# EasyEDA Pro project PCB信仰尺子.eprj, board PCB信仰尺V1.0
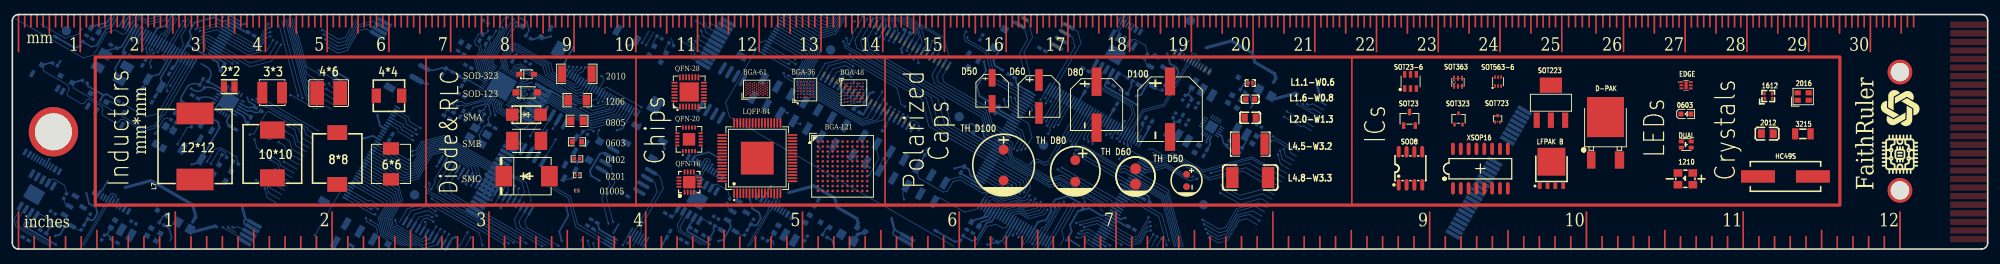
[diagram p0: board, top side]
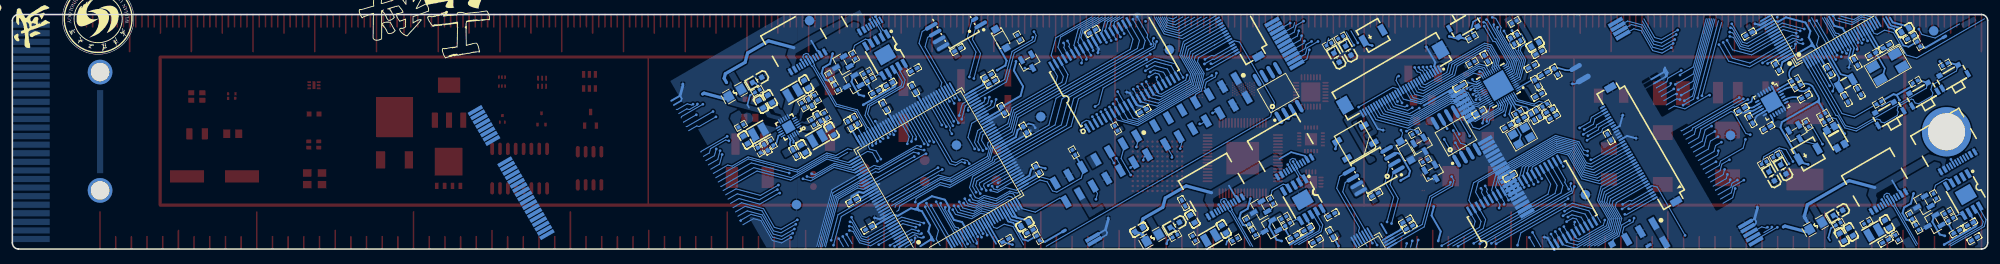
[diagram p1: board, bottom side, seen from below]

Outline 320 x 38 mm; copper layers: Top Layer, Bottom Layer. Coordinates in mm from the lower left corner of the outline.
Outline path: 0,37 0,1 arc(0.29,0.29) 1,0 319,0 arc(319.71,0.29) 320,1 320,37 arc(319.71,37.71) 319,38 1,38 arc(0.29,37.71) 0,37
Stack: Top Layer 0.035mm / Dielectric1 1.51mm FR4 er 4.5 / Bottom Layer 0.035mm

## Design rules (mm)
spacing copperThickness1oz (default): track to track 0.102, other pairs 0.152 to 0.3
spacing copperThickness2oz: track to track 0.203, other pairs 0.152 to 0.3
spacing Plane_innerPlane: track to track 0.102, other pairs 0.152 to 0.3
spacing Copper_copperRegion: track to track 0.102, other pairs 0.152 to 0.3
track width copperThickness1oz (default): min 0.127, default 0.254, max 2.54
track width copperThickness2oz: min 0.203, default 0.254, max 2.54
differential pair differentialPair (default): width min 0.127, default 0.254, max 2.54; gap min 0.152, default 0.152
via viaSize (default): diameter min 0.5, default 0.61, max 10; hole min 0.3, default 0.305, max 6.3
pour e5366 uses Copper_copperRegion
pour e5854 uses Copper_copperRegion

## Placement (name value [footprint] x y rotation side)
0603  KT-0603R  [LED0603-RD]  271.12 21.89 0 top
1210  597-7701-507F  [LED-SMD_4P-L3.0-W2.5_597-7701-507F]  271.03 11.38 0 top
1612  AMPDGEI-A09T  [OSC-SMD_4P-L1.6-W1.2-BL_ABRACON_AMPMG]  284.45 24.79 0 top
2012  100uH  [L0805]  284.3 18.7 0 top
2016  9S26000033  [OSC-SMD_4P-L2.0-W1.6-BL]  290.12 24.72 0 top
3215  32.768kHz  [FC-135R_L3.2-W1.5]  290.07 18.67 0 top
BUZZER1  -  [BUZ-SMD_L4.0-W4.0-P3.50-L]  29.07 15.4 150 bottom
BUZZER1#2  -  [BUZ-SMD_L4.0-W4.0-P3.50-L]  99.56 34.62 150 bottom
C1  -  [CAP-TH_BD8.0-P3.50-D0.6-FD_1]  172.2 12.65 270 top
C1#2  -  [C0402]  25.68 28.88 60 bottom
C2  -  [CAP-TH_BD6.3-P2.50-D0.6-FD]  181.96 11.76 270 top
C2#2  -  [C0402]  20.78 25.48 240 bottom
C3  10pF  [C0402]  22.89 24.29 240 bottom
C4  100nF  [C0402]  21.34 30.24 60 bottom
C5  22pF  [C0402]  18.62 31.58 150 bottom
C6  -  [CAP-SMD_L1.1-W0.6]  200.53 26.9 0 top
C6#2  -  [C0402]  16.44 32.84 330 bottom
C6#3  -  [C0402]  159.06 1.4 330 bottom
C7  -  [C0402]  12.49 34.31 330 bottom
C7#2  -  [C0402]  155.11 2.87 330 bottom
C8  100nF  [C0402]  153.91 12.87 60 bottom
C9  -  [CAP-SMD_L4.5-W3.2-1]  200.53 17 0 top
C9#2  -  [C0402]  155.96 19.35 60 bottom
C10  100nF  [C0402]  159.52 22.53 60 bottom
C11  -  [C0402]  94.24 4.53 330 bottom
C11#2  -  [C0402]  161.91 28.03 330 bottom
C12  -  [C0402]  106.31 2.42 60 bottom
C12#2  -  [C0402]  173.98 25.91 60 bottom
C13  -  [C0402]  108.79 1.27 150 bottom
C13#2  -  [C0402]  2.15 1.67 150 bottom
C13#3  -  [C0402]  178.68 23.06 60 bottom
C14  100nF  [C0402]  184.37 20.19 60 bottom
C15  100nF  [C0402]  183.79 7.81 330 bottom
C16  -  [C0402]  38.67 34.85 330 bottom
C16#2  -  [C0402]  181.29 3.4 330 bottom
C17  100nF  [C0402]  34.09 29.42 60 bottom
C18  -  [C0402]  99.21 8.83 150 bottom
C18#2  -  [C0402]  166.88 32.32 150 bottom
C19  100nF  [C0402]  136.76 22.4 330 bottom
C20  -  [C0402]  77.36 11.78 330 bottom
C20#2  -  [C0402]  145.03 35.28 330 bottom
C21  100nF  [C0402]  61.31 18.12 240 bottom
C22  -  [C0603]  13.35 35.48 150 bottom
C22#2  -  [C0603]  155.98 4.03 150 bottom
C23  2.2uF  [C0402]  183.36 20.79 60 bottom
C24  -  [C0402]  93.64 3.53 330 bottom
C24#2  -  [C0402]  161.31 27.02 330 bottom
C25  100nF  [C0402]  38.36 20.88 240 bottom
C26  100nF  [C0402]  35.7 19.65 150 bottom
C28  -  [C0402]  112.45 1.95 330 bottom
C28#2  -  [C0402]  5.01 2.78 330 bottom
C28#3  -  [C0402]  180.12 25.44 330 bottom
C30  10nF  [C0402]  39.85 22.64 330 bottom
C40  -  [C0402]  110.27 3.22 150 bottom
C40#2  -  [C0402]  2.82 4.06 150 bottom
C40#3  -  [C0402]  177.93 26.72 150 bottom
C41  -  [C0402]  106.25 5.55 330 bottom
C41#2  -  [C0402]  173.91 29.04 330 bottom
C42  -  [C0603]  128.83 4.88 60 bottom
C42#2  -  [C0603]  23.62 1.92 60 bottom
C42#3  -  [C0603]  198.73 23.46 60 bottom
C43  -  [C0603]  137.49 3.13 150 bottom
C43#2  -  [C0603]  22.16 2.78 60 bottom
C43#3  -  [C0603]  197.27 24.32 60 bottom
C44  220pF  [C0402]  197.9 16.45 240 bottom
C45  10uF  [C0603]  201.22 17.7 60 bottom
C46  -  [C0402]  130.28 7.45 240 bottom
C46#2  -  [C0402]  16.54 1.27 330 bottom
C46#3  -  [C0402]  190.76 23.73 240 bottom
C47  -  [C0603]  123.75 3.22 240 bottom
C47#2  -  [C0603]  16.3 4.06 240 bottom
C47#3  -  [C0603]  191.41 26.72 240 bottom
C48  220pF  [C0402]  189.35 21.22 240 bottom
C49  10uF  [C0603]  187.28 19.09 240 bottom
C50  10uF  [C0603]  191.88 16.24 60 bottom
C51  1uF  [C0402]  193.26 15.58 60 bottom
C70  100nF  [C0402]  72.73 24.94 330 bottom
C71  10uF  [C0603]  73.31 33.16 150 bottom
C72  1uF  [C0402]  72.7 31.83 330 bottom
C73  100nF  [C0402]  73.88 29.58 330 bottom
C74  TBD  [C0402]  69.94 28.77 240 bottom
C75  TBD  [C0402]  73.09 26.92 240 bottom
C76  270pF(NC)  [C0402]  75.95 34.27 60 bottom
C77  270pF(NC)  [C0402]  76.96 33.7 240 bottom
C78  100nF  [C0402]  81.27 30.91 240 bottom
C79  4.7uF  [C0402]  85.46 26.37 150 bottom
C80  100nF  [C0402]  82.34 22.14 150 bottom
C81  22pF  [C0402]  77.75 19.85 150 bottom
C82  22pF  [C0402]  75.56 21.06 330 bottom
C83  1uF  [C0402]  73.69 21.41 60 bottom
C84  100pF  [C0402]  72.83 21.91 60 bottom
C85  3.3nF  [C0402]  70.96 22.38 150 bottom
C86  10nF  [C0402]  70.39 21.38 330 bottom
C87  2.2nF  [C0402]  29.62 24.66 150 bottom
D1  -  [DO-214AC_L4.3-W2.7-LS5.3-RD]  83.27 21.77 0 top
D1#2  -  [SOD-123_L2.7-W1.6-LS3.8-RD]  94.28 15.93 240 bottom
D1#3  -  [SOD-123_L2.7-W1.6-LS3.8-RD]  159.87 34.12 240 bottom
D2  -  [SOD-323_L1.8-W1.3-LS2.5-RD]  83.31 28.32 0 top
D50  100uF  [CAP-SMD_BD5.0-L5.3-W5.3-FD]  158.72 25.65 270 top
D60  47uF  [CAP-SMD_BD6.3-L6.6-W6.6-LS7.2-FD]  166.32 24.73 270 top
D80  220uF  [CAP-SMD_BD8.0-L8.3-W8.3-LS9.3-FD]  175.64 23.39 270 top
D100  470uF  [CAP-SMD_BD10.0-L10.3-W10.3-LS11.3-FD]  187.55 22.66 270 top
D-PAK  L78M05ABDT-TR  [TO-252-2_L6.5-W6.1-P4.58-LS10.0-TL]  258.06 17.91 90 top
DUAL  YELLOWBLUE/RED  [LED-ARRAY-SMD_4P-L1.6-W1.5-BR-1]  271.17 16.94 180 top
EDGE  MIC5308-1.2YMT-TR  [MLF-6_L1.6-W1.6-P0.50-TL-EP]  271.14 26.55 0 top
F1  -  [F0805]  135.27 1.81 330 bottom
F1#2  -  [F0805]  27.82 3.76 330 bottom
F1#3  -  [F0805]  202.93 25.3 330 bottom
FPC1  -  [FPC-SMD_F0502-B-35-15T-R]  56.97 16.28 60 bottom
FPC2  -  [FPC-SMD_30P-P0.50_XUNPU_FPC-05F-30PH20]  95.74 26.67 330 bottom
H1  -  [HDR-SMD_14P-P2.54-H-F-R2-C7-S3.50]  127.46 22.28 330 bottom
H2  -  [HDR-SMD_14P-P2.54-H-F-R2-C7-S3.50]  143.58 12.99 330 bottom
HC49S  8MHz  [CRYSTAL-SMD_L11.5-W4.8-LS12.7]  287.25 11.76 0 top
L1  -  [IND-SMD_L4.0-W4.0]  42.09 25.34 0 top
L1#2  -  [IND-SMD_L2.5-W2.0_252012]  125.88 1.84 330 bottom
L1#3  -  [IND-SMD_L2.5-W2.0_252012]  18.44 2.68 330 bottom
L1#4  -  [IND-SMD_L2.5-W2.0_252012]  193.55 25.33 330 bottom
L2  1.5uH  [IND-SMD_L2.5-W2.0_252012]  189.59 17.95 330 bottom
L3  -  [IND-SMD_L4.5-W3.6_SQC453226T-4R7K-N]  51.25 25.26 0 top
L3#2  -  [L0402]  71.83 28.39 330 bottom
L4  220uH  [IND-SMD_L6.2-W6.2-MBH6045C-221MA]  61.34 13.79 90 top
L5  1uH  [IND-SMD_L5.0-W5.0_CHILISIN_HPPC05030]  61.01 24.85 180 top
L6  330nH  [IND-SMD_L8.0-W8.0_CHILISIN_HPPC08040B]  52.63 14.67 90 top
L7  220nH  [IND-SMD_L12.0-W12.0_CHILISIN_HPPC12040]  29.59 16.62 90 top
L8  4.7uH  [IND-SMD_L2.0-W1.6-B]  35.14 26.32 0 top
L13  1.5uH  [IND-SMD_L2.5-W2.0_252012]  199.12 18.97 330 bottom
LED1  -  [LED0603-R-RD]  34.98 11.79 60 bottom
LED1#2  -  [LED0603-R-RD]  105.47 31.02 60 bottom
LED2  -  [LED0603-R-RD]  33.08 12.92 60 bottom
LED2#2  -  [LED0603-R-RD]  103.57 32.15 60 bottom
LED3  -  [LED-SMD_4P-L3.2-W2.7-R-RD]  24.62 18.12 240 bottom
LED4  -  [WS2812B]  102.42 17.34 150 bottom
LED5  -  [LED0603-R-RD]  131.67 3.9 330 bottom
LED5#2  -  [LED0603-R-RD]  24.23 5.86 330 bottom
LED5#3  -  [LED0603-R-RD]  199.34 27.4 330 bottom
LFPAK B  PSMN4R0-60YS,115  [LFPAK56-4_L4.9-W4.2-P1.27-LS6.2-BL]  249.33 12.19 0 top
NOREF  -  [Pad_e225]  127.65 20.29 0 top
NOREF#2  -  [Pad_e291]  113.12 31.93 240 top
NOREF#3  -  [Pad_e125]  81.13 20.68 0 top
NOREF#4  -  [Pad_e13]  3.89 5.45 330 top
NOREF#5  -  [Pad_e753]  32.76 31.73 60 top
NOREF#6  -  [Pad_e725]  157.36 7.16 60 top
NOREF#7  -  [Pad_e374]  163.78 0.91 0 top
NOREF#8  -  [Pad_e117]  93.2 22.9 0 top
NOREF#9  -  [Pad_e194]  160.46 28.98 0 top
NOREF#10  -  [Pad_e87]  64.3 14.47 0 top
NOREF#11  -  [Pad_e70]  46.29 24.83 0 top
NOREF#12  -  [Pad_e290]  113.52 32.62 240 top
NOREF#13  -  [Pad_e68]  45.04 24.93 0 top
NOREF#14  -  [Pad_e514]  82.63 36.07 150 top
NOREF#15  -  [Pad_e544]  141.24 35.65 150 top
NOREF#16  -  [Pad_e684]  183.38 14.14 60 top
NOREF#17  -  [Pad_e307]  41.7 11.24 0 top
NOREF#18  -  [Pad_e517]  144.7 33.65 150 top
NOREF#19  -  [Pad_e174]  166.19 21.03 0 top
NOREF#20  -  [Pad_e37]  41.78 34.46 0 top
NOREF#21  -  [Pad_e75]  50.38 25.11 0 top
NOREF#22  -  [Pad_e82]  65.5 18.58 0 top
NOREF#23  -  [Pad_e515]  85.8 0.46 0 top
NOREF#24  -  [Pad_e431]  52.32 1.08 330 top
NOREF#25  -  [Pad_e398]  71.82 1.93 0 top
NOREF#26  -  [Pad_e275]  179.86 14.24 0 top
NOREF#27  -  [Pad_e495]  163.12 36.33 60 top
NOREF#28  -  [Pad_e20]  22.61 32.26 0 top
NOREF#29  -  [Pad_e341]  171.91 7.44 0 top
NOREF#30  -  [Pad_e319]  144.15 31.81 0 top
NOREF#31  -  [Pad_e180]  166.75 20.44 0 top
NOREF#32  -  [Pad_e287]  114.72 34.7 240 top
NOREF#33  -  [Pad_e132]  206.01 21.42 0 top
NOREF#34  -  [Pad_e457]  72.19 12.95 150 top
NOREF#35  -  [Pad_e306]  40.53 11.17 0 top
NOREF#36  -  [Pad_e433]  54.94 0.57 330 top
NOREF#37  -  [Pad_e542]  136.84 24.81 150 top
NOREF#38  -  [Pad_e118]  92.08 22.85 0 top
NOREF#39  -  [Pad_e410]  75.09 10 0 top
NOREF#40  -  [Pad_e565]  65.16 8.8 0 top
NOREF#41  -  [Pad_e612]  182.44 17.62 60 top
NOREF#42  -  [Pad_e362]  172.33 4.21 0 top
NOREF#43  -  [Pad_e357]  161.92 10.28 0 top
NOREF#44  -  [Pad_e101]  110.82 36.94 0 top
NOREF#45  -  [Pad_e270]  191.28 11.76 0 top
NOREF#46  -  [Pad_e354]  162.96 9.71 0 top
NOREF#47  -  [Pad_e737]  156.42 10.65 60 top
NOREF#48  -  [Pad_e245]  136.45 28.89 0 top
NOREF#49  -  [Pad_e326]  195.68 9.07 0 top
NOREF#50  -  [Pad_e154]  172.83 16.62 0 top
NOREF#51  -  [Pad_e232]  140.94 25.51 0 top
NOREF#52  -  [Pad_e677]  163.67 23.2 60 top
NOREF#53  -  [Pad_e10]  5.77 10.71 330 top
NOREF#54  -  [Pad_e553]  131.99 27.61 150 top
NOREF#55  -  [Pad_e136]  205.35 15.93 0 top
NOREF#56  -  [Pad_e328]  195.9 10.37 0 top
NOREF#57  -  [Pad_e538]  138.22 24.01 150 top
NOREF#58  -  [Pad_e1]  6.65 19 0 top
NOREF#59  -  [Pad_e618]  181.15 18.37 60 top
NOREF#60  -  [Pad_e392]  58.17 6.54 0 top
NOREF#61  -  [Pad_e732]  166.88 1.66 60 top
NOREF#62  -  [Pad_e74]  49.65 24.94 0 top
NOREF#63  -  [Pad_e654]  179.63 7.64 60 top
NOREF#64  -  [Pad_e293]  112.32 30.54 240 top
NOREF#65  -  [Pad_e170]  163.43 16.07 0 top
NOREF#66  -  [Pad_e163]  173.19 15.49 0 top
NOREF#67  -  [Pad_e396]  70.05 2.84 0 top
NOREF#68  -  [Pad_e670]  181.63 11.11 60 top
NOREF#69  -  [Pad_e736]  156.17 10.21 60 top
NOREF#70  -  [Pad_e247]  136.32 27.13 0 top
NOREF#71  -  [Pad_e731]  166.45 1.91 60 top
NOREF#72  -  [Pad_e480]  124.05 36.07 60 top
NOREF#73  -  [Pad_e715]  159.52 5.91 60 top
NOREF#74  -  [Pad_e757]  18.63 36.36 60 top
NOREF#75  -  [Pad_e605]  97.26 1.87 150 top
NOREF#76  -  [Pad_e527]  148.86 31.24 150 top
NOREF#77  -  [Pad_e690]  158.17 13.68 60 top
NOREF#78  -  [Pad_e523]  141.68 22.01 150 top
NOREF#79  -  [Pad_e80]  49.84 28.2 0 top
NOREF#80  -  [Pad_e264]  145.28 31.41 0 top
NOREF#81  -  [Pad_e583]  89.01 1.31 0 top
NOREF#82  -  [Pad_e652]  179.38 7.21 60 top
NOREF#83  -  [Pad_e593]  177.08 0.45 0 top
NOREF#84  -  [Pad_e672]  181.88 11.54 60 top
NOREF#85  -  [Pad_e569]  40.9 9.82 0 top
NOREF#86  -  [Pad_e406]  72.23 11.41 0 top
NOREF#87  -  [Pad_e601]  101.36 1.87 60 top
NOREF#88  -  [Pad_e248]  137.02 26.73 0 top
NOREF#89  -  [Pad_e533]  143.76 20.81 150 top
NOREF#90  -  [Pad_e750]  35.51 36.49 60 top
NOREF#91  -  [Pad_e487]  180.61 36.4 330 top
NOREF#92  -  [Pad_e49]  31.55 14.18 0 top
NOREF#93  -  [Pad_e485]  179.74 36.89 330 top
NOREF#94  -  [Pad_e659]  161.42 19.31 60 top
NOREF#95  -  [Pad_e489]  181.47 35.89 330 top
NOREF#96  -  [Pad_e631]  175.95 21.37 60 top
NOREF#97  -  [Pad_e502]  193.23 29.14 330 top
NOREF#98  -  [Pad_e478]  123.55 35.2 60 top
NOREF#99  -  [Pad_e689]  157.92 13.25 60 top
NOREF#100  -  [Pad_e241]  146.84 19.95 0 top
NOREF#101  -  [Pad_e401]  79.14 6.65 0 top
NOREF#102  -  [Pad_e473]  122.3 33.04 60 top
NOREF#103  -  [Pad_e404]  77.25 8.67 0 top
NOREF#104  -  [Pad_e531]  145.4 33.24 150 top
NOREF#105  -  [Pad_e208]  83.08 25.68 0 top
NOREF#106  -  [Pad_e516]  88.44 0.54 0 top
NOREF#107  -  [Pad_e277]  29.07 13.71 0 top
NOREF#108  -  [Pad_e230]  141.53 13.94 0 top
NOREF#109  -  [Pad_e588]  83.25 0.92 0 top
NOREF#110  -  [Pad_e492]  67.37 29.05 240 top
NOREF#111  -  [Pad_e40]  43.52 33.13 0 top
NOREF#112  -  [Pad_e262]  140.49 34.37 0 top
NOREF#113  -  [Pad_e137]  205.01 15.32 0 top
NOREF#114  -  [Pad_e21]  22.87 31.7 0 top
NOREF#115  -  [Pad_e472]  122.05 32.6 60 top
NOREF#116  -  [Pad_e758]  17.76 36.86 60 top
NOREF#117  -  [Pad_e251]  136.23 30.73 0 top
NOREF#118  -  [Pad_e143]  182.04 24.79 0 top
NOREF#119  -  [Pad_e379]  67.86 9.7 0 top
NOREF#120  -  [Pad_e540]  137.53 24.41 150 top
NOREF#121  -  [Pad_e31]  50.69 33.96 0 top
NOREF#122  -  [Pad_e635]  174.22 22.37 60 top
NOREF#123  -  [Pad_e430]  54.07 4.11 330 top
NOREF#124  -  [Pad_e299]  7.04 0.71 0 top
NOREF#125  -  [Pad_e765]  21.66 34.61 60 top
NOREF#126  -  [Pad_e334]  184.84 2.39 0 top
NOREF#127  -  [Pad_e196]  78.23 21.67 0 top
NOREF#128  -  [Pad_e65]  42.61 12.9 0 top
NOREF#129  -  [Pad_e783]  29.46 30.11 60 top
NOREF#130  -  [Pad_e698]  176.63 2.44 60 top
NOREF#131  -  [Pad_e310]  25.1 25.58 0 top
NOREF#132  -  [Pad_e338]  173.73 7.61 0 top
NOREF#133  -  [Pad_e666]  181.13 10.24 60 top
NOREF#134  -  [Pad_e317]  119.44 8.17 0 top
NOREF#135  -  [Pad_e551]  139.16 36.84 150 top
NOREF#136  -  [Pad_e244]  135.66 28.68 0 top
NOREF#137  -  [Pad_e630]  176.38 21.12 60 top
NOREF#138  -  [Pad_e209]  83.78 25.85 0 top
NOREF#139  -  [Pad_e541]  142.63 34.84 150 top
NOREF#140  -  [Pad_e694]  159.17 15.41 60 top
NOREF#141  -  [Pad_e239]  145.03 21.45 0 top
NOREF#142  -  [Pad_e150]  178.93 17.89 0 top
NOREF#143  -  [Pad_e3]  305.79 9.5 0 top
NOREF#144  -  [Pad_e373]  163.6 2 0 top
NOREF#145  -  [Pad_e723]  157.79 6.91 60 top
NOREF#146  -  [Pad_e785]  32.51 31.29 60 top
NOREF#147  -  [Pad_e481]  124.3 36.5 60 top
NOREF#148  -  [Pad_e353]  162.23 9.49 0 top
NOREF#149  -  [Pad_e437]  64.32 4.12 150 top
NOREF#150  -  [Pad_e748]  35.01 35.62 60 top
NOREF#151  -  [Pad_e449]  76.35 10.55 150 top
NOREF#152  -  [Pad_e210]  84.37 26.01 0 top
NOREF#153  -  [Pad_e205]  82.9 24.19 0 top
NOREF#154  -  [Pad_e77]  50.84 25.96 0 top
NOREF#155  -  [Pad_e763]  20.8 35.11 60 top
NOREF#156  -  [Pad_e24]  24.41 31.41 0 top
NOREF#157  -  [Pad_e771]  24.26 33.11 60 top
NOREF#158  -  [Pad_e494]  169.24 32.8 60 top
NOREF#159  -  [Pad_e218]  95.41 28.03 0 top
NOREF#160  -  [Pad_e524]  143.07 21.21 150 top
NOREF#161  -  [Pad_e14]  5.96 14.52 0 top
NOREF#162  -  [Pad_e368]  173.76 1.78 0 top
NOREF#163  -  [Pad_e104]  111.15 34.57 0 top
NOREF#164  -  [Pad_e699]  176.88 2.88 60 top
NOREF#165  -  [Pad_e581]  37.99 1.93 60 top
NOREF#166  -  [Pad_e460]  79.81 8.55 150 top
NOREF#167  -  [Pad_e351]  164.98 7.94 0 top
NOREF#168  -  [Pad_e286]  115.12 35.39 240 top
NOREF#169  -  [Pad_e179]  168.19 23.93 0 top
NOREF#170  -  [Pad_e640]  172.05 23.62 60 top
NOREF#171  -  [Pad_e546]  140.55 36.05 150 top
NOREF#172  -  [Pad_e356]  163.88 9.2 0 top
NOREF#173  -  [Pad_e559]  138.47 37.24 0 top
NOREF#174  -  [Pad_e550]  133.37 26.81 150 top
NOREF#175  -  [Pad_e261]  139.89 34.91 0 top
NOREF#176  -  [Pad_e680]  182.88 13.27 60 top
NOREF#177  -  [Pad_e188]  161.72 24.62 0 top
NOREF#178  -  [Pad_e52]  23.15 18.69 0 top
NOREF#179  -  [Pad_e770]  23.83 33.36 60 top
NOREF#180  -  [Pad_e348]  166.6 7.64 0 top
NOREF#181  -  [Pad_e577]  157.97 0.7 0 top
NOREF#182  -  [Pad_e428]  87.22 34.46 0 top
NOREF#183  -  [Pad_e9]  3.53 8.83 150 top
NOREF#184  -  [Pad_e439]  74.27 11.75 150 top
NOREF#185  -  [Pad_e84]  66.11 19.63 0 top
NOREF#186  -  [Pad_e96]  81.66 36.76 0 top
NOREF#187  -  [Pad_e713]  159.95 5.66 60 top
NOREF#188  -  [Pad_e668]  181.38 10.67 60 top
NOREF#189  -  [Pad_e34]  41.45 36.49 0 top
NOREF#190  -  [Pad_e322]  193.08 4.02 0 top
NOREF#191  -  [Pad_e759]  19.06 36.11 60 top
NOREF#192  -  [Pad_e263]  144.91 32.16 0 top
NOREF#193  -  [Pad_e422]  94.12 0.91 0 top
NOREF#194  -  [Pad_e27]  27.69 37.01 0 top
NOREF#195  -  [Pad_e325]  193.86 1.86 0 top
NOREF#196  -  [Pad_e323]  193.31 3.25 0 top
NOREF#197  -  [Pad_e57]  38.47 18.54 0 top
NOREF#198  -  [Pad_e281]  56.96 17.95 0 top
NOREF#199  -  [Pad_e81]  49.64 28.95 0 top
NOREF#200  -  [Pad_e85]  64.76 18.35 0 top
NOREF#201  -  [Pad_e617]  168.16 25.87 60 top
NOREF#202  -  [Pad_e315]  123.72 7.68 0 top
NOREF#203  -  [Pad_e384]  68 5.19 0 top
NOREF#204  -  [Pad_e558]  137.76 37.64 0 top
NOREF#205  -  [Pad_e739]  156.92 11.51 60 top
NOREF#206  -  [Pad_e126]  208.13 23.46 0 top
NOREF#207  -  [Pad_e43]  30.73 34.42 0 top
NOREF#208  -  [Pad_e633]  175.08 21.87 60 top
NOREF#209  -  [Pad_e554]  151.63 29.64 150 top
NOREF#210  -  [Pad_e114]  125.67 28.12 0 top
NOREF#211  -  [Pad_e120]  94.88 23.68 0 top
NOREF#212  -  [Pad_e394]  59.14 7.24 0 top
NOREF#213  -  [Pad_e370]  162.99 1.91 0 top
NOREF#214  -  [Pad_e730]  166.02 2.16 60 top
NOREF#215  -  [Pad_e182]  167.63 19.98 0 top
NOREF#216  -  [Pad_e123]  95.05 19.27 0 top
NOREF#217  -  [Pad_e673]  163.17 22.34 60 top
NOREF#218  -  [Pad_e615]  179.85 19.12 60 top
NOREF#219  -  [Pad_e339]  170.34 7.66 0 top
NOREF#220  -  [Pad_e64]  41.83 14.46 0 top
NOREF#221  -  [Pad_e128]  209.73 23.47 0 top
NOREF#222  -  [Pad_e458]  65.71 3.32 150 top
NOREF#223  -  [Pad_e346]  167.46 7.03 0 top
NOREF#224  -  [Pad_e304]  37.32 6.8 0 top
NOREF#225  -  [Pad_e100]  99.7 32.97 0 top
NOREF#226  -  [Pad_e650]  179.13 6.78 60 top
NOREF#227  -  [Pad_e773]  25.13 32.61 60 top
NOREF#228  -  [Pad_e169]  164.1 16.23 0 top
NOREF#229  -  [Pad_e90]  77.06 35.4 0 top
NOREF#230  -  [Pad_e722]  163.85 3.41 60 top
NOREF#231  -  [Pad_e459]  81.2 7.75 150 top
NOREF#232  -  [Pad_e423]  98.92 0.65 0 top
NOREF#233  -  [Pad_e62]  44.19 19.06 0 top
NOREF#234  -  [Pad_e113]  124.95 28.51 0 top
NOREF#235  -  [Pad_e48]  34.1 37.56 0 top
NOREF#236  -  [Pad_e429]  136.43 36.9 0 top
NOREF#237  -  [Pad_e426]  101.9 23 0 top
NOREF#238  -  [Pad_e696]  159.67 16.28 60 top
NOREF#239  -  [Pad_e424]  99.67 0.96 0 top
NOREF#240  -  [Pad_e461]  81.89 7.35 150 top
NOREF#241  -  [Pad_e94]  80.01 36.36 0 top
NOREF#242  -  [Pad_e297]  59.49 35.37 240 top
NOREF#243  -  [Pad_e592]  177.82 0.6 0 top
NOREF#244  -  [Pad_e63]  44.71 19.92 0 top
NOREF#245  -  [Pad_e555]  150.94 30.04 150 top
NOREF#246  -  [Pad_e313]  142.48 5.02 0 top
NOREF#247  -  [Pad_e728]  165.15 2.66 60 top
NOREF#248  -  [Pad_e45]  29.91 33.29 0 top
NOREF#249  -  [Pad_e283]  111.92 29.85 240 top
NOREF#250  -  [Pad_e171]  162.77 15.96 0 top
NOREF#251  -  [Pad_e228]  138.86 13.2 0 top
NOREF#252  -  [Pad_e549]  139.85 36.45 150 top
NOREF#253  -  [Pad_e173]  165.15 22.47 0 top
NOREF#254  -  [Pad_e233]  141.15 24.28 0 top
NOREF#255  -  [Pad_e476]  123.05 34.34 60 top
NOREF#256  -  [Pad_e164]  173.88 14.99 0 top
NOREF#257  -  [Pad_e28]  28.86 37.01 0 top
NOREF#258  -  [Pad_e292]  112.72 31.23 240 top
NOREF#259  -  [Pad_e665]  162.17 20.61 60 top
NOREF#260  -  [Pad_e375]  144.46 8.06 0 top
NOREF#261  -  [Pad_e26]  25.04 37.83 0 top
NOREF#262  -  [Pad_e685]  164.67 24.94 60 top
NOREF#263  -  [Pad_e414]  86.83 11.73 0 top
NOREF#264  -  [Pad_e760]  19.5 35.86 60 top
NOREF#265  -  [Pad_e175]  166.62 21.64 0 top
NOREF#266  -  [Pad_e66]  42.16 12.1 0 top
NOREF#267  -  [Pad_e115]  129.69 28.2 0 top
NOREF#268  -  [Pad_e479]  123.8 35.64 60 top
NOREF#269  -  [Pad_e372]  162.75 2.5 0 top
NOREF#270  -  [Pad_e229]  138.82 12 0 top
NOREF#271  -  [Pad_e105]  110.68 33.72 0 top
NOREF#272  -  [Pad_e497]  164.1 37.24 60 top
NOREF#273  -  [Pad_e47]  29.71 35.66 0 top
NOREF#274  -  [Pad_e144]  182.15 23.37 0 top
NOREF#275  -  [Pad_e158]  171.65 16.87 0 top
NOREF#276  -  [Pad_e608]  96.51 0.57 150 top
NOREF#277  -  [Pad_e7]  4.91 11.21 330 top
NOREF#278  -  [Pad_e135]  205.97 16.22 0 top
NOREF#279  -  [Pad_e69]  46.98 24.46 0 top
NOREF#280  -  [Pad_e309]  36.47 30.16 0 top
NOREF#281  -  [Pad_e510]  189.64 31.21 330 top
NOREF#282  -  [Pad_e223]  132.15 14.85 0 top
NOREF#283  -  [Pad_e15]  19.45 33.73 0 top
NOREF#284  -  [Pad_e217]  92.83 29.44 0 top
NOREF#285  -  [Pad_e466]  82.58 6.95 150 top
NOREF#286  -  [Pad_e199]  88.04 17.77 0 top
NOREF#287  -  [Pad_e195]  155.97 29.33 0 top
NOREF#288  -  [Pad_e563]  153.39 21.44 0 top
NOREF#289  -  [Pad_e780]  28.16 30.86 60 top
NOREF#290  -  [Pad_e337]  211.39 26.74 0 top
NOREF#291  -  [Pad_e483]  124.8 37.37 60 top
NOREF#292  -  [Pad_e236]  142.94 22.6 0 top
NOREF#293  -  [Pad_e537]  144.01 34.05 150 top
NOREF#294  -  [Pad_e697]  176.38 2.01 60 top
NOREF#295  -  [Pad_e380]  68.55 6.14 0 top
NOREF#296  -  [Pad_e332]  184.4 3.01 0 top
NOREF#297  -  [Pad_e395]  69.35 3.24 0 top
NOREF#298  -  [Pad_e641]  171.62 23.87 60 top
NOREF#299  -  [Pad_e629]  176.82 20.87 60 top
NOREF#300  -  [Pad_e386]  66.9 4.38 0 top
NOREF#301  -  [Pad_e131]  206.49 22.29 0 top
NOREF#302  -  [Pad_e663]  161.92 20.17 60 top
NOREF#303  -  [Pad_e227]  136.79 14.42 0 top
NOREF#304  -  [Pad_e470]  121.55 31.74 60 top
NOREF#305  -  [Pad_e59]  43.13 17.32 0 top
NOREF#306  -  [Pad_e603]  102.22 1.37 60 top
NOREF#307  -  [Pad_e91]  78.35 35.35 0 top
NOREF#308  -  [Pad_e740]  157.17 11.95 60 top
NOREF#309  -  [Pad_e134]  203.93 17.53 0 top
NOREF#310  -  [Pad_e331]  184.41 3.7 0 top
NOREF#311  -  [Pad_e448]  77.04 10.15 150 top
NOREF#312  -  [Pad_e700]  177.13 3.31 60 top
NOREF#313  -  [Pad_e752]  18.2 36.61 60 top
NOREF#314  -  [Pad_e172]  162.2 16.26 0 top
NOREF#315  -  [Pad_e367]  172.39 1.93 0 top
NOREF#316  -  [Pad_e397]  70.73 2.43 0 top
NOREF#317  -  [Pad_e197]  68.76 13.4 0 top
NOREF#318  -  [Pad_e729]  165.58 2.41 60 top
NOREF#319  -  [Pad_e193]  164.97 27.89 0 top
NOREF#320  -  [Pad_e646]  178.63 5.91 60 top
NOREF#321  -  [Pad_e61]  43.68 18.2 0 top
NOREF#322  -  [Pad_e289]  113.92 33.31 240 top
NOREF#323  -  [Pad_e649]  160.17 17.14 60 top
NOREF#324  -  [Pad_e660]  180.38 8.94 60 top
NOREF#325  -  [Pad_e693]  158.92 14.98 60 top
NOREF#326  -  [Pad_e657]  161.17 18.87 60 top
NOREF#327  -  [Pad_e413]  96.57 4.14 0 top
NOREF#328  -  [Pad_e616]  181.58 18.12 60 top
NOREF#329  -  [Pad_e226]  137.91 16.54 0 top
NOREF#330  -  [Pad_e679]  163.92 23.64 60 top
NOREF#331  -  [Pad_e590]  186.97 0.62 0 top
NOREF#332  -  [Pad_e545]  134.76 26.01 150 top
NOREF#333  -  [Pad_e300]  12 9.01 0 top
NOREF#334  -  [Pad_e56]  40.24 24.55 0 top
NOREF#335  -  [Pad_e391]  58.79 5.62 0 top
NOREF#336  -  [Pad_e576]  144.65 1.25 60 top
NOREF#337  -  [Pad_e211]  83.48 27.49 0 top
NOREF#338  -  [Pad_e237]  143.66 22.25 0 top
NOREF#339  -  [Pad_e548]  134.06 26.41 150 top
NOREF#340  -  [Pad_e23]  23.72 31.17 0 top
NOREF#341  -  [Pad_e639]  172.49 23.37 60 top
NOREF#342  -  [Pad_e148]  177.83 18.62 0 top
NOREF#343  -  [Pad_e257]  149.71 33.4 0 top
NOREF#344  -  [Pad_e687]  164.92 25.37 60 top
NOREF#345  -  [Pad_e714]  162.12 4.41 60 top
NOREF#346  -  [Pad_e704]  178.13 5.04 60 top
NOREF#347  -  [Pad_e491]  179.31 37.14 330 top
NOREF#348  -  [Pad_e147]  177.2 18.51 0 top
NOREF#349  -  [Pad_e72]  49.34 23.32 0 top
NOREF#350  -  [Pad_e73]  49.86 24.23 0 top
NOREF#351  -  [Pad_e279]  7.75 30.4 0 top
NOREF#352  -  [Pad_e768]  22.96 33.86 60 top
NOREF#353  -  [Pad_e749]  35.26 36.06 60 top
NOREF#354  -  [Pad_e435]  60.86 0.79 330 top
NOREF#355  -  [Pad_e103]  111.6 35.38 0 top
NOREF#356  -  [Pad_e267]  154.49 35.23 0 top
NOREF#357  -  [Pad_e407]  72.82 10.87 0 top
NOREF#358  -  [Pad_e511]  190.07 30.96 330 top
NOREF#359  -  [Pad_e474]  122.55 33.47 60 top
NOREF#360  -  [Pad_e330]  184.29 4.41 0 top
NOREF#361  -  [Pad_e440]  73.57 12.15 150 top
NOREF#362  -  [Pad_e176]  166.58 24.14 0 top
NOREF#363  -  [Pad_e717]  159.09 6.16 60 top
NOREF#364  -  [Pad_e651]  160.42 17.58 60 top
NOREF#365  -  [Pad_e636]  173.78 22.62 60 top
NOREF#366  -  [Pad_e352]  164.8 8.7 0 top
NOREF#367  -  [Pad_e745]  34.26 34.33 60 top
NOREF#368  -  [Pad_e288]  114.32 34.01 240 top
NOREF#369  -  [Pad_e543]  135.45 25.61 150 top
NOREF#370  -  [Pad_e678]  182.63 12.84 60 top
NOREF#371  -  [Pad_e345]  167.66 6.38 0 top
NOREF#372  -  [Pad_e22]  23.55 31.89 0 top
NOREF#373  -  [Pad_e671]  162.92 21.91 60 top
NOREF#374  -  [Pad_e280]  59.12 21.69 0 top
NOREF#375  -  [Pad_e585]  80.4 0.92 0 top
NOREF#376  -  [Pad_e613]  167.72 26.12 60 top
NOREF#377  -  [Pad_e416]  90.62 11.45 0 top
NOREF#378  -  [Pad_e273]  180.67 16.77 0 top
NOREF#379  -  [Pad_e155]  173.65 17.8 0 top
NOREF#380  -  [Pad_e536]  136.14 25.21 150 top
NOREF#381  -  [Pad_e521]  145.84 19.61 150 top
NOREF#382  -  [Pad_e53]  28.93 26.01 0 top
NOREF#383  -  [Pad_e36]  41.79 35.15 0 top
NOREF#384  -  [Pad_e119]  94.05 23.22 0 top
NOREF#385  -  [Pad_e12]  6.64 10.21 330 top
NOREF#386  -  [Pad_e562]  167.06 16.84 0 top
NOREF#387  -  [Pad_e626]  178.12 20.12 60 top
NOREF#388  -  [Pad_e503]  193.93 28.74 330 top
NOREF#389  -  [Pad_e638]  172.92 23.12 60 top
NOREF#390  -  [Pad_e116]  130.35 27.81 0 top
NOREF#391  -  [Pad_e269]  190.52 12.2 0 top
NOREF#392  -  [Pad_e471]  121.8 32.17 60 top
NOREF#393  -  [Pad_e701]  177.38 3.74 60 top
NOREF#394  -  [Pad_e512]  87.2 35.74 60 top
NOREF#395  -  [Pad_e755]  33.26 32.59 60 top
NOREF#396  -  [Pad_e185]  169.42 20.09 0 top
NOREF#397  -  [Pad_e599]  100.49 2.37 60 top
NOREF#398  -  [Pad_e272]  180.1 17.1 0 top
NOREF#399  -  [Pad_e399]  73.73 2.7 0 top
NOREF#400  -  [Pad_e192]  164.24 27.63 0 top
NOREF#401  -  [Pad_e463]  78.42 9.35 150 top
NOREF#402  -  [Pad_e25]  24.6 30.73 0 top
NOREF#403  -  [Pad_e624]  178.55 19.87 60 top
NOREF#404  -  [Pad_e762]  20.36 35.36 60 top
NOREF#405  -  [Pad_e108]  109.89 32.29 0 top
NOREF#406  -  [Pad_e165]  170.04 13.18 0 top
NOREF#407  -  [Pad_e390]  58.01 4.63 0 top
NOREF#408  -  [Pad_e632]  175.52 21.62 60 top
NOREF#409  -  [Pad_e18]  20.99 33.45 0 top
NOREF#410  -  [Pad_e393]  59.22 6.49 0 top
NOREF#411  -  [Pad_e477]  123.3 34.77 60 top
NOREF#412  -  [Pad_e526]  146.78 32.45 150 top
NOREF#413  -  [Pad_e766]  22.09 34.36 60 top
NOREF#414  -  [Pad_e83]  65.37 19.36 0 top
NOREF#415  -  [Pad_e447]  77.73 9.75 150 top
NOREF#416  -  [Pad_e378]  67.51 10.63 0 top
NOREF#417  -  [Pad_e669]  162.67 21.47 60 top
NOREF#418  -  [Pad_e708]  175.88 1.15 60 top
NOREF#419  -  [Pad_e385]  68.21 4.43 0 top
NOREF#420  -  [Pad_e213]  90.2 29.59 0 top
NOREF#421  -  [Pad_e653]  160.67 18.01 60 top
NOREF#422  -  [Pad_e451]  74.96 11.35 150 top
NOREF#423  -  [Pad_e552]  132.68 27.21 150 top
NOREF#424  -  [Pad_e695]  159.42 15.84 60 top
NOREF#425  -  [Pad_e469]  118.14 31.23 60 top
NOREF#426  -  [Pad_e604]  102.66 1.12 60 top
NOREF#427  -  [Pad_e580]  38.41 2.64 60 top
NOREF#428  -  [Pad_e691]  158.42 14.11 60 top
NOREF#429  -  [Pad_e452]  68.48 1.72 150 top
NOREF#430  -  [Pad_e634]  174.65 22.12 60 top
NOREF#431  -  [Pad_e402]  78.34 7.24 0 top
NOREF#432  -  [Pad_e619]  179.41 19.37 60 top
NOREF#433  -  [Pad_e727]  156.92 7.41 60 top
NOREF#434  -  [Pad_e215]  91.48 29.5 0 top
NOREF#435  -  [Pad_e520]  140.3 22.81 150 top
NOREF#436  -  [Pad_e609]  105.17 0.49 0 top
NOREF#437  -  [Pad_e35]  41.66 35.86 0 top
NOREF#438  -  [Pad_e716]  162.55 4.16 60 top
NOREF#439  -  [Pad_e335]  185.47 2.04 0 top
NOREF#440  -  [Pad_e712]  161.69 4.66 60 top
NOREF#441  -  [Pad_e561]  191.92 11.39 0 top
NOREF#442  -  [Pad_e231]  141.15 14.72 0 top
NOREF#443  -  [Pad_e349]  165.89 7.46 0 top
NOREF#444  -  [Pad_e645]  169.89 24.87 60 top
NOREF#445  -  [Pad_e688]  157.67 12.81 60 top
NOREF#446  -  [Pad_e166]  169.35 12.89 0 top
NOREF#447  -  [Pad_e751]  35.76 36.92 60 top
NOREF#448  -  [Pad_e421]  93.22 1.33 0 top
NOREF#449  -  [Pad_e146]  180.19 37.67 0 top
NOREF#450  -  [Pad_e55]  39.58 24.35 0 top
NOREF#451  -  [Pad_e198]  86.22 17.22 0 top
NOREF#452  -  [Pad_e539]  143.32 34.44 150 top
NOREF#453  -  [Pad_e336]  186.12 1.68 0 top
NOREF#454  -  [Pad_e784]  32.26 30.86 60 top
NOREF#455  -  [Pad_e29]  50.21 35.49 0 top
NOREF#456  -  [Pad_e369]  174.35 1.45 0 top
NOREF#457  -  [Pad_e138]  194.14 12.31 0 top
NOREF#458  -  [Pad_e189]  162.42 24.46 0 top
NOREF#459  -  [Pad_e106]  108.48 33.64 0 top
NOREF#460  -  [Pad_e2]  305.79 28.68 0 top
NOREF#461  -  [Pad_e525]  142.38 21.61 150 top
NOREF#462  -  [Pad_e445]  70.55 0.52 150 top
NOREF#463  -  [Pad_e443]  70.81 13.75 150 top
NOREF#464  -  [Pad_e366]  172.71 2.52 0 top
NOREF#465  -  [Pad_e733]  167.31 1.41 60 top
NOREF#466  -  [Pad_e522]  145.15 20.01 150 top
NOREF#467  -  [Pad_e234]  141.67 23.55 0 top
NOREF#468  -  [Pad_e250]  138.4 25.92 0 top
NOREF#469  -  [Pad_e594]  165.24 0.81 0 top
NOREF#470  -  [Pad_e312]  22.47 29.43 0 top
NOREF#471  -  [Pad_e329]  184.05 5.16 0 top
NOREF#472  -  [Pad_e622]  178.98 19.62 60 top
NOREF#473  -  [Pad_e719]  158.66 6.41 60 top
NOREF#474  -  [Pad_e432]  56.27 2.84 330 top
NOREF#475  -  [Pad_e764]  21.23 34.86 60 top
NOREF#476  -  [Pad_e518]  138.91 23.61 150 top
NOREF#477  -  [Pad_e109]  125.84 30.03 0 top
NOREF#478  -  [Pad_e141]  191.39 31.18 0 top
NOREF#479  -  [Pad_e202]  83.91 18.31 0 top
NOREF#480  -  [Pad_e602]  101.79 1.62 60 top
NOREF#481  -  [Pad_e183]  167.8 18.67 0 top
NOREF#482  -  [Pad_e662]  180.63 9.37 60 top
NOREF#483  -  [Pad_e738]  156.67 11.08 60 top
NOREF#484  -  [Pad_e509]  189.07 31.54 330 top
NOREF#485  -  [Pad_e664]  180.88 9.81 60 top
NOREF#486  -  [Pad_e268]  154.69 34.32 0 top
NOREF#487  -  [Pad_e92]  80.25 37.54 0 top
NOREF#488  -  [Pad_e761]  19.93 35.61 60 top
NOREF#489  -  [Pad_e572]  35.67 3.53 0 top
NOREF#490  -  [Pad_e389]  57.28 5.01 0 top
NOREF#491  -  [Pad_e568]  190.86 37.01 0 top
NOREF#492  -  [Pad_e607]  96.76 1.01 150 top
NOREF#493  -  [Pad_e46]  31.14 33.23 0 top
NOREF#494  -  [Pad_e720]  163.42 3.66 60 top
NOREF#495  -  [Pad_e465]  69.86 0.92 150 top
NOREF#496  -  [Pad_e157]  172.29 17.04 0 top
NOREF#497  -  [Pad_e786]  11.15 35.64 0 top
NOREF#498  -  [Pad_e19]  21.15 32.36 0 top
NOREF#499  -  [Pad_e623]  169.02 25.37 60 top
NOREF#500  -  [Pad_e249]  137.71 26.33 0 top
NOREF#501  -  [Pad_e743]  33.76 33.46 60 top
NOREF#502  -  [Pad_e747]  34.76 35.19 60 top
NOREF#503  -  [Pad_e191]  157.42 30.4 0 top
NOREF#504  -  [Pad_e124]  81.84 20.39 0 top
NOREF#505  -  [Pad_e417]  95.1 11.1 0 top
NOREF#506  -  [Pad_e442]  69.42 14.55 150 top
NOREF#507  -  [Pad_e89]  64.8 15.87 0 top
NOREF#508  -  [Pad_e505]  190.94 30.46 330 top
NOREF#509  -  [Pad_e682]  183.13 13.7 60 top
NOREF#510  -  [Pad_e484]  182.73 35.17 330 top
NOREF#511  -  [Pad_e586]  81.21 1.02 0 top
NOREF#512  -  [Pad_e284]  115.92 36.78 240 top
NOREF#513  -  [Pad_e579]  38.84 3.38 60 top
NOREF#514  -  [Pad_e252]  135.66 31.58 0 top
NOREF#515  -  [Pad_e498]  170.5 35 60 top
NOREF#516  -  [Pad_e566]  41.66 18.42 0 top
NOREF#517  -  [Pad_e364]  173.63 3.54 0 top
NOREF#518  -  [Pad_e187]  161.36 23.93 0 top
NOREF#519  -  [Pad_e294]  59.09 34.67 240 top
NOREF#520  -  [Pad_e160]  170.72 17.33 0 top
NOREF#521  -  [Pad_e573]  139.48 25.43 0 top
NOREF#522  -  [Pad_e207]  83.38 25.04 0 top
NOREF#523  -  [Pad_e453]  67.78 2.12 150 top
NOREF#524  -  [Pad_e186]  160.63 24.25 0 top
NOREF#525  -  [Pad_e493]  66.25 27.11 240 top
NOREF#526  -  [Pad_e418]  97.3 4.39 0 top
NOREF#527  -  [Pad_e656]  179.88 8.07 60 top
NOREF#528  -  [Pad_e152]  176.96 19.13 0 top
NOREF#529  -  [Pad_e238]  144.33 21.83 0 top
NOREF#530  -  [Pad_e212]  82.3 28.76 0 top
NOREF#531  -  [Pad_e161]  172.28 16.04 0 top
NOREF#532  -  [Pad_e436]  80.5 8.15 150 top
NOREF#533  -  [Pad_e488]  181.04 36.14 330 top
NOREF#534  -  [Pad_e142]  187.1 31.67 0 top
NOREF#535  -  [Pad_e642]  171.19 24.12 60 top
NOREF#536  -  [Pad_e643]  170.75 24.37 60 top
NOREF#537  -  [Pad_e98]  102.03 33.41 0 top
NOREF#538  -  [Pad_e371]  162.08 2.24 0 top
NOREF#539  -  [Pad_e571]  34.95 3.56 0 top
NOREF#540  -  [Pad_e621]  168.59 25.62 60 top
NOREF#541  -  [Pad_e774]  25.56 32.36 60 top
NOREF#542  -  [Pad_e376]  37.7 36.51 0 top
NOREF#543  -  [Pad_e499]  171.14 36.1 60 top
NOREF#544  -  [Pad_e127]  209.02 23.5 0 top
NOREF#545  -  [Pad_e168]  165.7 13.98 0 top
NOREF#546  -  [Pad_e79]  51.34 26.84 0 top
NOREF#547  -  [Pad_e363]  173 3.9 0 top
NOREF#548  -  [Pad_e741]  157.42 12.38 60 top
NOREF#549  -  [Pad_e674]  182.13 11.97 60 top
NOREF#550  -  [Pad_e778]  27.29 31.36 60 top
NOREF#551  -  [Pad_e456]  66.4 2.92 150 top
NOREF#552  -  [Pad_e302]  17.14 8.02 0 top
NOREF#553  -  [Pad_e204]  82.26 24.23 0 top
NOREF#554  -  [Pad_e253]  134.62 33.64 0 top
NOREF#555  -  [Pad_e468]  83.28 6.55 150 top
NOREF#556  -  [Pad_e686]  183.63 14.57 60 top
NOREF#557  -  [Pad_e258]  142.75 33.49 0 top
NOREF#558  -  [Pad_e320]  144.6 23.09 0 top
NOREF#559  -  [Pad_e311]  25.58 26.44 0 top
NOREF#560  -  [Pad_e254]  135.53 33.19 0 top
NOREF#561  -  [Pad_e278]  14.27 24.14 0 top
NOREF#562  -  [Pad_e754]  33.01 32.16 60 top
NOREF#563  -  [Pad_e242]  134.62 27.84 0 top
NOREF#564  -  [Pad_e221]  113.4 13.69 0 top
NOREF#565  -  [Pad_e30]  50.46 34.78 0 top
NOREF#566  -  [Pad_e121]  95.6 23.9 0 top
NOREF#567  -  [Pad_e285]  115.52 36.08 240 top
NOREF#568  -  [Pad_e383]  68.78 5.39 0 top
NOREF#569  -  [Pad_e39]  42.85 33.48 0 top
NOREF#570  -  [Pad_e177]  167.32 24.45 0 top
NOREF#571  -  [Pad_e107]  109.52 33.65 0 top
NOREF#572  -  [Pad_e243]  135.88 27.93 0 top
NOREF#573  -  [Pad_e711]  160.39 5.41 60 top
NOREF#574  -  [Pad_e38]  42.22 33.84 0 top
NOREF#575  -  [Pad_e97]  81.56 36.12 0 top
NOREF#576  -  [Pad_e475]  122.8 33.9 60 top
NOREF#577  -  [Pad_e721]  158.22 6.66 60 top
NOREF#578  -  [Pad_e710]  161.25 4.91 60 top
NOREF#579  -  [Pad_e496]  169.87 33.9 60 top
NOREF#580  -  [Pad_e206]  82.89 24.79 0 top
NOREF#581  -  [Pad_e387]  68.66 3.63 0 top
NOREF#582  -  [Pad_e706]  160.82 5.16 60 top
NOREF#583  -  [Pad_e702]  177.63 4.18 60 top
NOREF#584  -  [Pad_e350]  165.7 8.16 0 top
NOREF#585  -  [Pad_e587]  82.28 0.85 0 top
NOREF#586  -  [Pad_e467]  83.97 6.15 150 top
NOREF#587  -  [Pad_e340]  171.15 7.06 0 top
NOREF#588  -  [Pad_e112]  126.45 29.12 0 top
NOREF#589  -  [Pad_e501]  192.67 29.46 330 top
NOREF#590  -  [Pad_e327]  196.06 9.63 0 top
NOREF#591  -  [Pad_e41]  30.37 35.35 0 top
NOREF#592  -  [Pad_e403]  77.61 7.91 0 top
NOREF#593  -  [Pad_e153]  175.02 17.06 0 top
NOREF#594  -  [Pad_e358]  161.27 10.19 0 top
NOREF#595  -  [Pad_e661]  161.67 19.74 60 top
NOREF#596  -  [Pad_e567]  8.74 35.36 0 top
NOREF#597  -  [Pad_e769]  23.39 33.61 60 top
NOREF#598  -  [Pad_e637]  173.35 22.87 60 top
NOREF#599  -  [Pad_e415]  87.03 10.82 0 top
NOREF#600  -  [Pad_e434]  58.47 1.57 330 top
NOREF#601  -  [Pad_e500]  192.23 29.71 330 top
NOREF#602  -  [Pad_e167]  164.98 13.83 0 top
NOREF#603  -  [Pad_e589]  76.16 0.62 0 top
NOREF#604  -  [Pad_e365]  173.2 2.92 0 top
NOREF#605  -  [Pad_e276]  152.65 13.06 0 top
NOREF#606  -  [Pad_e42]  31.01 34.98 0 top
NOREF#607  -  [Pad_e149]  178.13 18.04 0 top
NOREF#608  -  [Pad_e513]  85.62 34.34 150 top
NOREF#609  -  [Pad_e438]  63.63 4.52 150 top
NOREF#610  -  [Pad_e110]  126.89 29.99 0 top
NOREF#611  -  [Pad_e409]  74.32 10.27 0 top
NOREF#612  -  [Pad_e255]  135.1 34.17 0 top
NOREF#613  -  [Pad_e178]  167.43 23.61 0 top
NOREF#614  -  [Pad_e271]  179.4 17.43 0 top
NOREF#615  -  [Pad_e614]  182.01 17.87 60 top
NOREF#616  -  [Pad_e420]  92.26 1.47 0 top
NOREF#617  -  [Pad_e705]  178.38 5.48 60 top
NOREF#618  -  [Pad_e767]  22.53 34.11 60 top
NOREF#619  -  [Pad_e625]  169.46 25.12 60 top
NOREF#620  -  [Pad_e377]  66.95 10.14 0 top
NOREF#621  -  [Pad_e235]  142.27 23.02 0 top
NOREF#622  -  [Pad_e486]  180.17 36.65 330 top
NOREF#623  -  [Pad_e658]  180.13 8.51 60 top
NOREF#624  -  [Pad_e655]  160.92 18.44 60 top
NOREF#625  -  [Pad_e425]  97.93 19.25 0 top
NOREF#626  -  [Pad_e156]  174.34 17.43 0 top
NOREF#627  -  [Pad_e4]  3.17 12.21 330 top
NOREF#628  -  [Pad_e122]  94.15 19.09 0 top
NOREF#629  -  [Pad_e33]  51.23 32.62 0 top
NOREF#630  -  [Pad_e259]  142 33.77 0 top
NOREF#631  -  [Pad_e557]  150.25 30.44 150 top
NOREF#632  -  [Pad_e145]  181.06 37.18 0 top
NOREF#633  -  [Pad_e775]  25.99 32.11 60 top
NOREF#634  -  [Pad_e781]  28.59 30.61 60 top
NOREF#635  -  [Pad_e534]  144.46 20.41 150 top
NOREF#636  -  [Pad_e454]  67.09 2.52 150 top
NOREF#637  -  [Pad_e547]  131.29 28.01 150 top
NOREF#638  -  [Pad_e683]  164.42 24.5 60 top
NOREF#639  -  [Pad_e519]  140.99 22.41 150 top
NOREF#640  -  [Pad_e219]  105.67 16.22 0 top
NOREF#641  -  [Pad_e777]  26.86 31.61 60 top
NOREF#642  -  [Pad_e324]  193.57 2.57 0 top
NOREF#643  -  [Pad_e274]  179.31 14.57 0 top
NOREF#644  -  [Pad_e214]  90.84 29.49 0 top
NOREF#645  -  [Pad_e282]  67.28 26.78 0 top
NOREF#646  -  [Pad_e216]  92.15 29.44 0 top
NOREF#647  -  [Pad_e411]  81.4 10.24 0 top
NOREF#648  -  [Pad_e676]  182.38 12.4 60 top
NOREF#649  -  [Pad_e201]  85.6 18.62 0 top
NOREF#650  -  [Pad_e681]  164.17 24.07 60 top
NOREF#651  -  [Pad_e692]  158.67 14.54 60 top
NOREF#652  -  [Pad_e628]  177.25 20.62 60 top
NOREF#653  -  [Pad_e133]  204.2 18.26 0 top
NOREF#654  -  [Pad_e111]  126.8 30.74 0 top
NOREF#655  -  [Pad_e382]  67.97 8.17 0 top
NOREF#656  -  [Pad_e464]  69.17 1.32 150 top
NOREF#657  -  [Pad_e296]  59.89 36.06 240 top
NOREF#658  -  [Pad_e595]  132.99 0.86 0 top
NOREF#659  -  [Pad_e314]  136.64 3.49 0 top
NOREF#660  -  [Pad_e388]  62.03 4.7 0 top
NOREF#661  -  [Pad_e139]  204.3 26.99 0 top
NOREF#662  -  [Pad_e508]  188.38 31.94 330 top
NOREF#663  -  [Pad_e532]  139.61 23.21 150 top
NOREF#664  -  [Pad_e647]  159.92 16.71 60 top
NOREF#665  -  [Pad_e76]  50.12 25.81 0 top
NOREF#666  -  [Pad_e772]  24.69 32.86 60 top
NOREF#667  -  [Pad_e6]  1.29 6.95 330 top
NOREF#668  -  [Pad_e343]  169.6 7.43 0 top
NOREF#669  -  [Pad_e316]  124.59 7.18 0 top
NOREF#670  -  [Pad_e190]  154.29 19.64 0 top
NOREF#671  -  [Pad_e102]  112.99 36.62 0 top
NOREF#672  -  [Pad_e5]  4.04 11.71 330 top
NOREF#673  -  [Pad_e298]  6.94 2.13 0 top
NOREF#674  -  [Pad_e782]  29.02 30.36 60 top
NOREF#675  -  [Pad_e535]  141.93 35.25 150 top
NOREF#676  -  [Pad_e455]  72.88 12.55 150 top
NOREF#677  -  [Pad_e462]  79.12 8.95 150 top
NOREF#678  -  [Pad_e162]  171.98 15.43 0 top
NOREF#679  -  [Pad_e570]  34.07 3.52 0 top
NOREF#680  -  [Pad_e8]  2.16 6.45 330 top
NOREF#681  -  [Pad_e342]  172.11 6.84 0 top
NOREF#682  -  [Pad_e644]  170.32 24.62 60 top
NOREF#683  -  [Pad_e99]  102.67 33.03 0 top
NOREF#684  -  [Pad_e222]  130.81 16.27 0 top
NOREF#685  -  [Pad_e93]  81.19 37.18 0 top
NOREF#686  -  [Pad_e203]  87.57 19.51 0 top
NOREF#687  -  [Pad_e17]  20.36 33.36 0 top
NOREF#688  -  [Pad_e506]  191.37 30.21 330 top
NOREF#689  -  [Pad_e606]  97.01 1.44 150 top
NOREF#690  -  [Pad_e140]  192.25 30.67 0 top
NOREF#691  -  [Pad_e361]  160.32 10.73 0 top
NOREF#692  -  [Pad_e597]  97.81 3.3 60 top
NOREF#693  -  [Pad_e381]  68.45 7.24 0 top
NOREF#694  -  [Pad_e181]  167.49 20.7 0 top
NOREF#695  -  [Pad_e67]  44.01 14.15 0 top
NOREF#696  -  [Pad_e419]  89.74 6.9 0 top
NOREF#697  -  [Pad_e58]  39.23 17.77 0 top
NOREF#698  -  [Pad_e347]  166.76 6.91 0 top
NOREF#699  -  [Pad_e734]  167.75 1.16 60 top
NOREF#700  -  [Pad_e355]  163.2 8.99 0 top
NOREF#701  -  [Pad_e11]  3.02 5.95 330 top
NOREF#702  -  [Pad_e507]  191.8 29.96 330 top
NOREF#703  -  [Pad_e333]  180.33 5.06 0 top
NOREF#704  -  [Pad_e490]  182.04 35.57 330 top
NOREF#705  -  [Pad_e224]  125.57 22.05 0 top
NOREF#706  -  [Pad_e709]  176.13 1.58 60 top
NOREF#707  -  [Pad_e675]  163.42 22.77 60 top
NOREF#708  -  [Pad_e600]  100.92 2.12 60 top
NOREF#709  -  [Pad_e51]  26.76 17 0 top
NOREF#710  -  [Pad_e703]  177.88 4.61 60 top
NOREF#711  -  [Pad_e726]  164.72 2.91 60 top
NOREF#712  -  [Pad_e16]  20.13 33.94 0 top
NOREF#713  -  [Pad_e560]  192.97 7.19 0 top
NOREF#714  -  [Pad_e584]  79.63 0.84 0 top
NOREF#715  -  [Pad_e564]  132.56 32.29 0 top
NOREF#716  -  [Pad_e344]  168.86 6.76 0 top
NOREF#717  -  [Pad_e620]  180.71 18.62 60 top
NOREF#718  -  [Pad_e648]  178.88 6.34 60 top
NOREF#719  -  [Pad_e504]  190.5 30.71 330 top
NOREF#720  -  [Pad_e301]  16.28 8.52 0 top
NOREF#721  -  [Pad_e321]  192.83 4.73 0 top
NOREF#722  -  [Pad_e32]  50.95 33.33 0 top
NOREF#723  -  [Pad_e88]  64.81 15.16 0 top
NOREF#724  -  [Pad_e627]  177.68 20.37 60 top
NOREF#725  -  [Pad_e596]  179.65 0.7 0 top
NOREF#726  -  [Pad_e556]  149.55 30.84 150 top
NOREF#727  -  [Pad_e611]  180.28 18.87 60 top
NOREF#728  -  [Pad_e528]  148.17 31.64 150 top
NOREF#729  -  [Pad_e746]  34.51 34.76 60 top
NOREF#730  -  [Pad_e441]  70.11 14.15 150 top
NOREF#731  -  [Pad_e308]  35.65 30.06 0 top
NOREF#732  -  [Pad_e530]  146.09 32.84 150 top
NOREF#733  -  [Pad_e450]  75.66 10.95 150 top
NOREF#734  -  [Pad_e240]  146.9 19.27 0 top
NOREF#735  -  [Pad_e86]  64.91 17.62 0 top
NOREF#736  -  [Pad_e591]  187.35 1.42 0 top
NOREF#737  -  [Pad_e60]  43.64 15.93 0 top
NOREF#738  -  [Pad_e412]  82.09 9.84 0 top
NOREF#739  -  [Pad_e578]  39.23 4.07 60 top
NOREF#740  -  [Pad_e575]  145.03 1.88 60 top
NOREF#741  -  [Pad_e78]  50.6 26.68 0 top
NOREF#742  -  [Pad_e184]  168.7 19.81 0 top
NOREF#743  -  [Pad_e359]  161.52 9.55 0 top
NOREF#744  -  [Pad_e151]  180.2 20.72 0 top
NOREF#745  -  [Pad_e610]  182.88 17.37 60 top
NOREF#746  -  [Pad_e260]  141.2 33.98 0 top
NOREF#747  -  [Pad_e776]  26.43 31.86 60 top
NOREF#748  -  [Pad_e295]  60.29 36.75 240 top
NOREF#749  -  [Pad_e408]  73.53 10.48 0 top
NOREF#750  -  [Pad_e44]  30.09 33.97 0 top
NOREF#751  -  [Pad_e220]  112.52 14.18 0 top
NOREF#752  -  [Pad_e265]  146.01 30.74 0 top
NOREF#753  -  [Pad_e667]  162.42 21.04 60 top
NOREF#754  -  [Pad_e724]  164.28 3.16 60 top
NOREF#755  -  [Pad_e318]  114.38 1.3 0 top
NOREF#756  -  [Pad_e305]  39.49 11.16 0 top
NOREF#757  -  [Pad_e303]  33.09 3.58 0 top
NOREF#758  -  [Pad_e50]  32.18 13.81 0 top
NOREF#759  -  [Pad_e598]  100.06 2.62 60 top
NOREF#760  -  [Pad_e71]  49.14 24.04 0 top
NOREF#761  -  [Pad_e529]  147.48 32.04 150 top
NOREF#762  -  [Pad_e779]  27.72 31.11 60 top
NOREF#763  -  [Pad_e54]  38.84 24.23 0 top
NOREF#764  -  [Pad_e405]  76.48 8.32 0 top
NOREF#765  -  [Pad_e707]  175.63 0.71 60 top
NOREF#766  -  [Pad_e744]  34.01 33.89 60 top
NOREF#767  -  [Pad_e200]  86.57 19.21 0 top
NOREF#768  -  [Pad_e256]  149.06 33.73 0 top
NOREF#769  -  [Pad_e582]  37.53 1.22 60 top
NOREF#770  -  [Pad_e574]  49.02 2.21 0 top
NOREF#771  -  [Pad_e360]  160.45 10.05 0 top
NOREF#772  -  [Pad_e735]  168.18 0.91 60 top
NOREF#773  -  [Pad_e95]  79.4 35.94 0 top
NOREF#774  -  [Pad_e130]  209.2 21.76 0 top
NOREF#775  -  [Pad_e446]  71.5 13.35 150 top
NOREF#776  -  [Pad_e400]  74.24 1.88 0 top
NOREF#777  -  [Pad_e742]  36.01 37.36 60 top
NOREF#778  -  [Pad_e266]  146.79 30.14 0 top
NOREF#779  -  [Pad_e482]  124.55 36.94 60 top
NOREF#780  -  [Pad_e129]  208.17 25.12 0 top
NOREF#781  -  [Pad_e427]  90.93 32.76 0 top
NOREF#782  -  [Pad_e246]  136.22 29.63 0 top
NOREF#783  -  [Pad_e718]  162.99 3.91 60 top
NOREF#784  -  [Pad_e444]  65.01 3.72 150 top
NOREF#785  -  [Pad_e756]  33.51 33.03 60 top
NOREF#786  -  [Pad_e159]  171.42 17.48 0 top
Q1  -  [SOT-23-3_L2.9-W1.3-P1.90-LS2.4-BR]  116.27 3.34 150 bottom
Q1#2  -  [SOT-23-3_L2.9-W1.3-P1.90-LS2.4-BR]  8.83 4.18 150 bottom
Q1#3  -  [SOT-23-3_L2.9-W1.3-P1.90-LS2.4-BR]  183.94 26.84 150 bottom
Q2  -  [SOT-23-3_L2.9-W1.3-P1.90-LS2.4-BR]  118.04 6.41 150 bottom
Q2#2  -  [SOT-23-3_L2.9-W1.3-P1.90-LS2.4-BR]  10.6 7.25 150 bottom
Q2#3  -  [SOT-23-3_L2.9-W1.3-P1.90-LS2.4-BR]  185.7 29.91 150 bottom
Q3  -  [SOT-23-3_L2.9-W1.3-P1.90-LS2.4-BR]  89.85 12.34 60 bottom
Q3#2  -  [SOT-23-3_L2.9-W1.3-P1.90-LS2.4-BR]  155.21 30.22 60 bottom
Q4  -  [SOT-23-3_L2.9-W1.3-P1.90-LS2.4-BR]  91.65 16.71 60 bottom
Q10  -  [SOT-23-3_L2.9-W1.3-P1.90-LS2.4-BR]  30.94 18.79 60 bottom
R1  -  [R0402]  91.47 14.61 0 top
R1#2  -  [R0402]  11.19 33.22 60 bottom
R1#3  -  [R0402]  153.81 1.77 60 bottom
R2  10kΩ  [R0402]  141.18 19.56 60 bottom
R3  0Ω  [R0402]  201.97 19.96 150 bottom
R5  0Ω  [R0402]  76.1 22.09 330 bottom
R6  0Ω  [R0402]  76.68 36.81 150 bottom
R9  -  [R0402]  36.24 13.97 150 bottom
R9#2  -  [R0402]  106.73 33.2 150 bottom
R10  -  [R0402]  34.34 15.07 150 bottom
R10#2  -  [R0402]  104.82 34.3 150 bottom
R14  10kΩ  [R0402]  6.91 29.89 330 bottom
R15  -  [R0402]  131.64 2.11 150 bottom
R15#2  -  [R0402]  24.2 4.06 150 bottom
R15#3  -  [R0402]  199.3 25.6 150 bottom
R16  10kΩ  [R0402]  148.05 15.67 240 bottom
R17  10kΩ  [R0402]  92.78 18.79 150 bottom
R18  -  [R0402]  113.42 3.99 330 bottom
R18#2  -  [R0402]  5.97 4.83 330 bottom
R18#3  -  [R0402]  181.08 27.49 330 bottom
R19  -  [R0402]  118.83 2.64 60 bottom
R19#2  -  [R0402]  11.39 3.48 60 bottom
R19#3  -  [R0402]  186.5 26.14 60 bottom
R20  -  [R0402]  114.01 5.07 330 bottom
R20#2  -  [R0402]  6.57 5.9 330 bottom
R20#3  -  [R0402]  181.68 28.56 330 bottom
R21  -  [R0402]  115.98 7.74 60 bottom
R21#2  -  [R0402]  8.54 8.58 60 bottom
R21#3  -  [R0402]  183.65 31.23 60 bottom
R22  -  [R0402]  119.85 4.44 240 bottom
R22#2  -  [R0402]  12.41 5.27 240 bottom
R22#3  -  [R0402]  187.52 27.93 240 bottom
R23  68kΩ  [R0402]  199.03 15.99 240 bottom
R24  15kΩ  [R0402]  196.95 17.19 60 bottom
R25  -  [R0402]  121.92 1.53 330 bottom
R25#2  -  [R0402]  14.69 1.87 240 bottom
R25#3  -  [R0402]  189.8 24.53 240 bottom
R26  -  [R0402]  128.57 1.73 240 bottom
R26#2  -  [R0402]  19.63 4.3 330 bottom
R26#3  -  [R0402]  191.91 23.28 240 bottom
R27  100kΩ  [R0402]  188.26 21.65 240 bottom
R28  100kΩ  [R0402]  190.34 20.51 240 bottom
R29  -  [R0402]  91.11 14.31 150 bottom
R29#2  -  [R0402]  156.97 34.29 240 bottom
R31  10kΩ  [R0402]  11.73 27.1 330 bottom
R32  10kΩ  [R0402]  17.63 23.7 150 bottom
R33  10kΩ  [R0402]  83.56 34.33 150 bottom
R34  1kΩ  [R0402]  29.2 20.21 60 bottom
R41  0Ω(NC)  [R0402]  83.52 30.2 330 bottom
R42  20kΩ  [R0402]  71.72 23.3 150 bottom
R62  47kΩ  [R0402]  26.67 21.77 150 bottom
R63  1kΩ  [R0402]  26.09 20.74 330 bottom
R64  4.7kΩ  [R0402]  31.29 27.37 150 bottom
R65  4.7kΩ  [R0402]  30.71 26.37 150 bottom
R01005  3.3Ω  [R01005]  91.44 9.48 0 top
R1006  50Ω  [R2010]  91.45 28.39 0 top
R1007  XM003Q  [QFN-20_L4.0-W4.0-P0.5-EP2.0]  109.61 17.78 0 top
SOO8  HY15P41-S008  [SOP-8_L4.9-W3.9-P1.27-LS6.0-BL]  226.49 13.08 0 top
SOT23  BAV70  [SOT-23-3_L3.0-W1.7-P0.95-LS2.9-BR]  226.33 21.1 270 top
SOT23-6  SOT23-6  [SOT-23-6_L2.9-W1.6-P0.95-LS2.8-BL]  226.51 27.16 0 top
SOT223  SOT223  [SOT-223-4_L6.5-W3.5-P2.30-LS7.0-BR]  249.25 23.71 270 top
SOT323  BAV99WT1G  [SC-70-3_L2.1-W1.3-P1.30-LS2.1-BR]  234.28 21.08 270 top
SOT363  74HC2G04GW-SOT363  [SOT-36-6_L2.0-W1.3-P0.65-BL]  234.19 27.03 0 top
SOT563-6  TMP302BDRLT  [SOT-563_L1.6-W1.2-P0.50-LS1.6-BL]  240.68 27.13 0 top
SOT723  CJ3134K KF  [SOT-723_L1.2-W0.8-P0.40-LS1.2-BR]  240.61 21.09 270 top
SW2  -  [KEY-SMD_K2-1806SA-AXXW-XX]  5.79 28.09 330 bottom
SW3  -  [KEY-SMD_K2-1806SA-AXXW-XX]  10.68 25.22 330 bottom
SW4  -  [KEY-SMD_K2-1806SA-AXXW-XX]  16.2 22.09 330 bottom
U1  CD106N-330M  [IND-SMD_L9.5-W9.5]  42.13 15.41 90 top
U2  -  [SOIC-8_L5.2-W5.2-P1.27-LS7.9-BL]  99.46 12.72 60 bottom
U3  -  [DO-214AA_L4.4-W3.6-LS5.3-RD]  83.31 17.53 0 top
U4  -  [DO-214AB_L6.9-W5.9-LS7.9-RD]  83.31 11.81 0 top
U4#2  -  [mini-pcie 0.8-52p]  56.38 27.61 240 bottom
U5  -  [SOD-123F_L2.7-W1.6-LS3.8-RD]  83.31 25.38 0 top
U5#2  -  [mini-pcie 0.8-52p]  215.16 24.15 240 bottom
U6  22uF  [CAP-TH_BD5.0-P2.00-D0.5-FD-1]  190.22 11.11 270 top
U7  -  [CAP-TH_BD10.0-P5.00-D0.6-FD]  160.58 13.61 270 top
U7#2  -  [R0603]  91.47 17.38 0 top
U8  0201WMJ0153T5E  [R0201]  91.51 11.94 0 top
U9  -  [R0805]  91.48 20.77 0 top
U9#2  -  [CAP-SMD_L1.6-W0.8-2]  200.53 24.29 0 top
U9#3  -  [ESOP-10_L4.9-W3.9-P1.00-LS6.2-BL-EP]  110.96 7.98 330 bottom
U9#4  -  [ESOP-10_L4.9-W3.9-P1.00-LS6.2-BL-EP]  178.62 31.48 330 bottom
U10  -  [CAP-SMD_L2.0-W1.3]  200.53 21.28 0 top
U10#2  -  [R1206]  91.52 24.13 0 top
U11  -  [CAP-SMD_L4.8-W3.3]  200.53 11.59 0 top
U11#2  -  [BGA-121_L10.0-W10.0-R11-C11-P0.80-TL]  134.49 13.41 0 top
U12  S912ZVML12AMKHR  [LQFP-64_L10.0-W10.0-P0.50-LS12.0-BL-EP5.3]  120.68 14.73 0 top
U13  MKL03Z16VFG4  [QFN-16_L3.0-W3.0-P0.50-BL-EP2.0]  109.65 10.84 0 top
U14  C8051F367-C-GMR  [QFN-28_L5.0-W5.0-P0.50-BL-EP3.1]  109.65 25.45 0 top
U15  EFM32TG825F32-BGA48T  [BGA-48_L4.0-W4.0-P0.50-TL_SILICON_EFM32TG825XXX]  136.33 25.35 0 top
U16  MKL17Z64VDA4R  [BGA-36_L3.5-W3.5-R6-R6-P0.50-BL]  128.35 25.96 0 top
U17  CS47L63-CWZR  [BGA-61_L4.1-W2.7-P0.40-BL]  120.57 25.94 0 top
U19  -  [WQFN-20_L3.0-W3.0-P0.40-BL-EP]  194.25 19.78 60 bottom
U20  -  [SOIC-8_L5.3-W5.3-P1.27-LS8.0-BL]  86.14 18.27 150 bottom
U20#2  -  [SOIC-8_L5.3-W5.3-P1.27-LS8.0-BL]  114.94 25.28 150 bottom
U22  -  [QFN-48_L5.0-W5.0-P0.35-BL-EP3.7]  79.25 26.49 60 bottom
U23  -  [QFN-24_L4.0-W4.0-P0.50-BL-EP2.7]  34.98 23.84 330 bottom
USB1  -  [USB-C-SMD_TYPE-C-31-M-31]  113.48 15.35 330 bottom
USB1#2  -  [USB-C-SMD_TYPE-C-31-M-31]  6.04 16.19 330 bottom
USB2  -  [USB-C-SMD_TYPE-C-31-M-31]  124.67 8.9 330 bottom
USB2#2  -  [USB-C-SMD_TYPE-C-31-M-31]  17.23 9.74 330 bottom
X1  32.768kHz  [FC-135R_L3.2-W1.5]  23 26.89 150 bottom
X2  8MHz  [OSC-SMD_4P-L5.0-W3.2-BL]  16.2 29.52 330 bottom
X6  40MHZ±10ppm  [OSC-SMD_4P-L3.2-W2.5-BL]  75.5 18.33 330 bottom
XSOP16  74HC595  [SMT-SOP16-X]  237.82 13.03 0 top

## Footprints (pads in the part's own frame, mm; a bottom-side part is the same pattern mirrored in y, then rotated)
BGA-36_L3.5-W3.5-R6-R6-P0.50-BL
  round 0.24 smd: A1(-1.113,-1.387) A2(-1.113,-0.886) A3(-1.113,-0.387) A4(-1.113,0.114) A5(-1.113,0.614) A6(-1.113,1.113) B1(-0.614,-1.387) B2(-0.614,-0.886) B3(-0.614,-0.387) B4(-0.614,0.114) B5(-0.614,0.614) B6(-0.614,1.113) C1(-0.114,-1.387) C2(-0.114,-0.886) C3(-0.114,-0.387) C4(-0.114,0.114) C5(-0.114,0.614) C6(-0.114,1.113) D1(0.387,-1.387) D2(0.387,-0.886) D3(0.387,-0.387) D4(0.387,0.114) D5(0.387,0.614) D6(0.387,1.113) E1(0.886,-1.387) E2(0.886,-0.886) E3(0.886,-0.387) E4(0.886,0.114) E5(0.886,0.614) E6(0.886,1.113) F1(1.387,-1.387) F2(1.387,-0.886) F3(1.387,-0.387) F4(1.387,0.114) F5(1.387,0.614) F6(1.387,1.113)
BGA-48_L4.0-W4.0-P0.50-TL_SILICON_EFM32TG825XXX
  round 0.24 smd: A1(-1.5,1.5) A2(-1,1.5) A3(-0.5,1.5) A4(0,1.5) A5(0.5,1.5) A6(1,1.5) A7(1.5,1.5) B1(-1.5,1) B2(-1,1) B3(-0.5,1) B4(0,1) B5(0.5,1) B6(1,1) B7(1.5,1) C1(-1.5,0.5) C2(-1,0.5) C3(-0.5,0.5) C4(0,0.5) C5(0.5,0.5) C6(1,0.5) C7(1.5,0.5) D1(-1.5,0) D2(-1,0) D3(-0.5,0) D5(0.5,0) D6(1,0) D7(1.5,0) E1(-1.5,-0.5) E2(-1,-0.5) E3(-0.5,-0.5) E4(0,-0.5) E5(0.5,-0.5) E6(1,-0.5) E7(1.5,-0.5) F1(-1.5,-1) F2(-1,-1) F3(-0.5,-1) F4(0,-1) F5(0.5,-1) F6(1,-1) F7(1.5,-1) G1(-1.5,-1.5) G2(-1,-1.5) G3(-0.5,-1.5) G4(0,-1.5) G5(0.5,-1.5) G6(1,-1.5) G7(1.5,-1.5)
BGA-61_L4.1-W2.7-P0.40-BL
  round 0.24 smd: A1(-1.73,-1) A3(-1.73,-0.6) A5(-1.73,-0.2) A7(-1.73,0.2) A9(-1.73,0.6) A11(-1.73,1) B2(-1.385,-0.8) B4(-1.385,-0.4) B6(-1.385,0) B8(-1.385,0.4) B10(-1.385,0.8) C1(-1.038,-1) C3(-1.038,-0.6) C5(-1.038,-0.2) C7(-1.038,0.2) C9(-1.038,0.6) C11(-1.038,1) D2(-0.692,-0.8) D4(-0.692,-0.4) D6(-0.692,0) D8(-0.692,0.4) D10(-0.692,0.8) E1(-0.346,-1) E3(-0.346,-0.6) E5(-0.346,-0.2) E7(-0.346,0.2) E9(-0.346,0.6) E11(-0.346,1) F2(0,-0.8) F4(0,-0.4) F6(0,0) F8(0,0.4) F10(0,0.8) G1(0.346,-1) G3(0.346,-0.6) G5(0.346,-0.2) G7(0.346,0.2) G9(0.346,0.6) G11(0.346,1) H2(0.692,-0.8) H4(0.692,-0.4) H6(0.692,0) H8(0.692,0.4) H10(0.692,0.8) J1(1.038,-1) J3(1.038,-0.6) J5(1.038,-0.2) J7(1.038,0.2) J9(1.038,0.6) J11(1.038,1) K2(1.385,-0.8) K4(1.385,-0.4) K6(1.385,0) K8(1.385,0.4) K10(1.385,0.8) L1(1.73,-1) L3(1.73,-0.6) L5(1.73,-0.2) L7(1.73,0.2) L9(1.73,0.6) L11(1.73,1)
